# Altium schematic sheet Sheet1.SchDoc
size A4; SheetNumber: 2; SheetTotal: 3
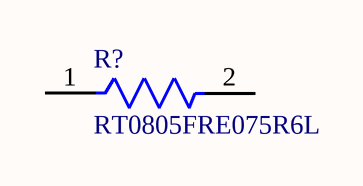
[diagram p0: Sheet1.SchDoc]

## Parts
R?  RT0805FRE075R6L  [FP-RT0805-MFG]

## Nets

Not connected (* = marked no-connect by the designer): R? 1 2

## Library data of the parts
R? = CMP-00027-00017-1: Fixed Resistor, Thin Film, 0.125W, 5.6ohm, 150V, 1% +/-Tol, 50ppm/Cel, Surface Mount, 0805; RoHS Compliant: Yes; Min Operating Temperature: -55°C; Mounting Technology: Surface Mount; Max Operating Temperature: 155°C; Pins: 2; Case/Package: 0805